# EAGLE schematic circuito (EAGLE 7.1.0)
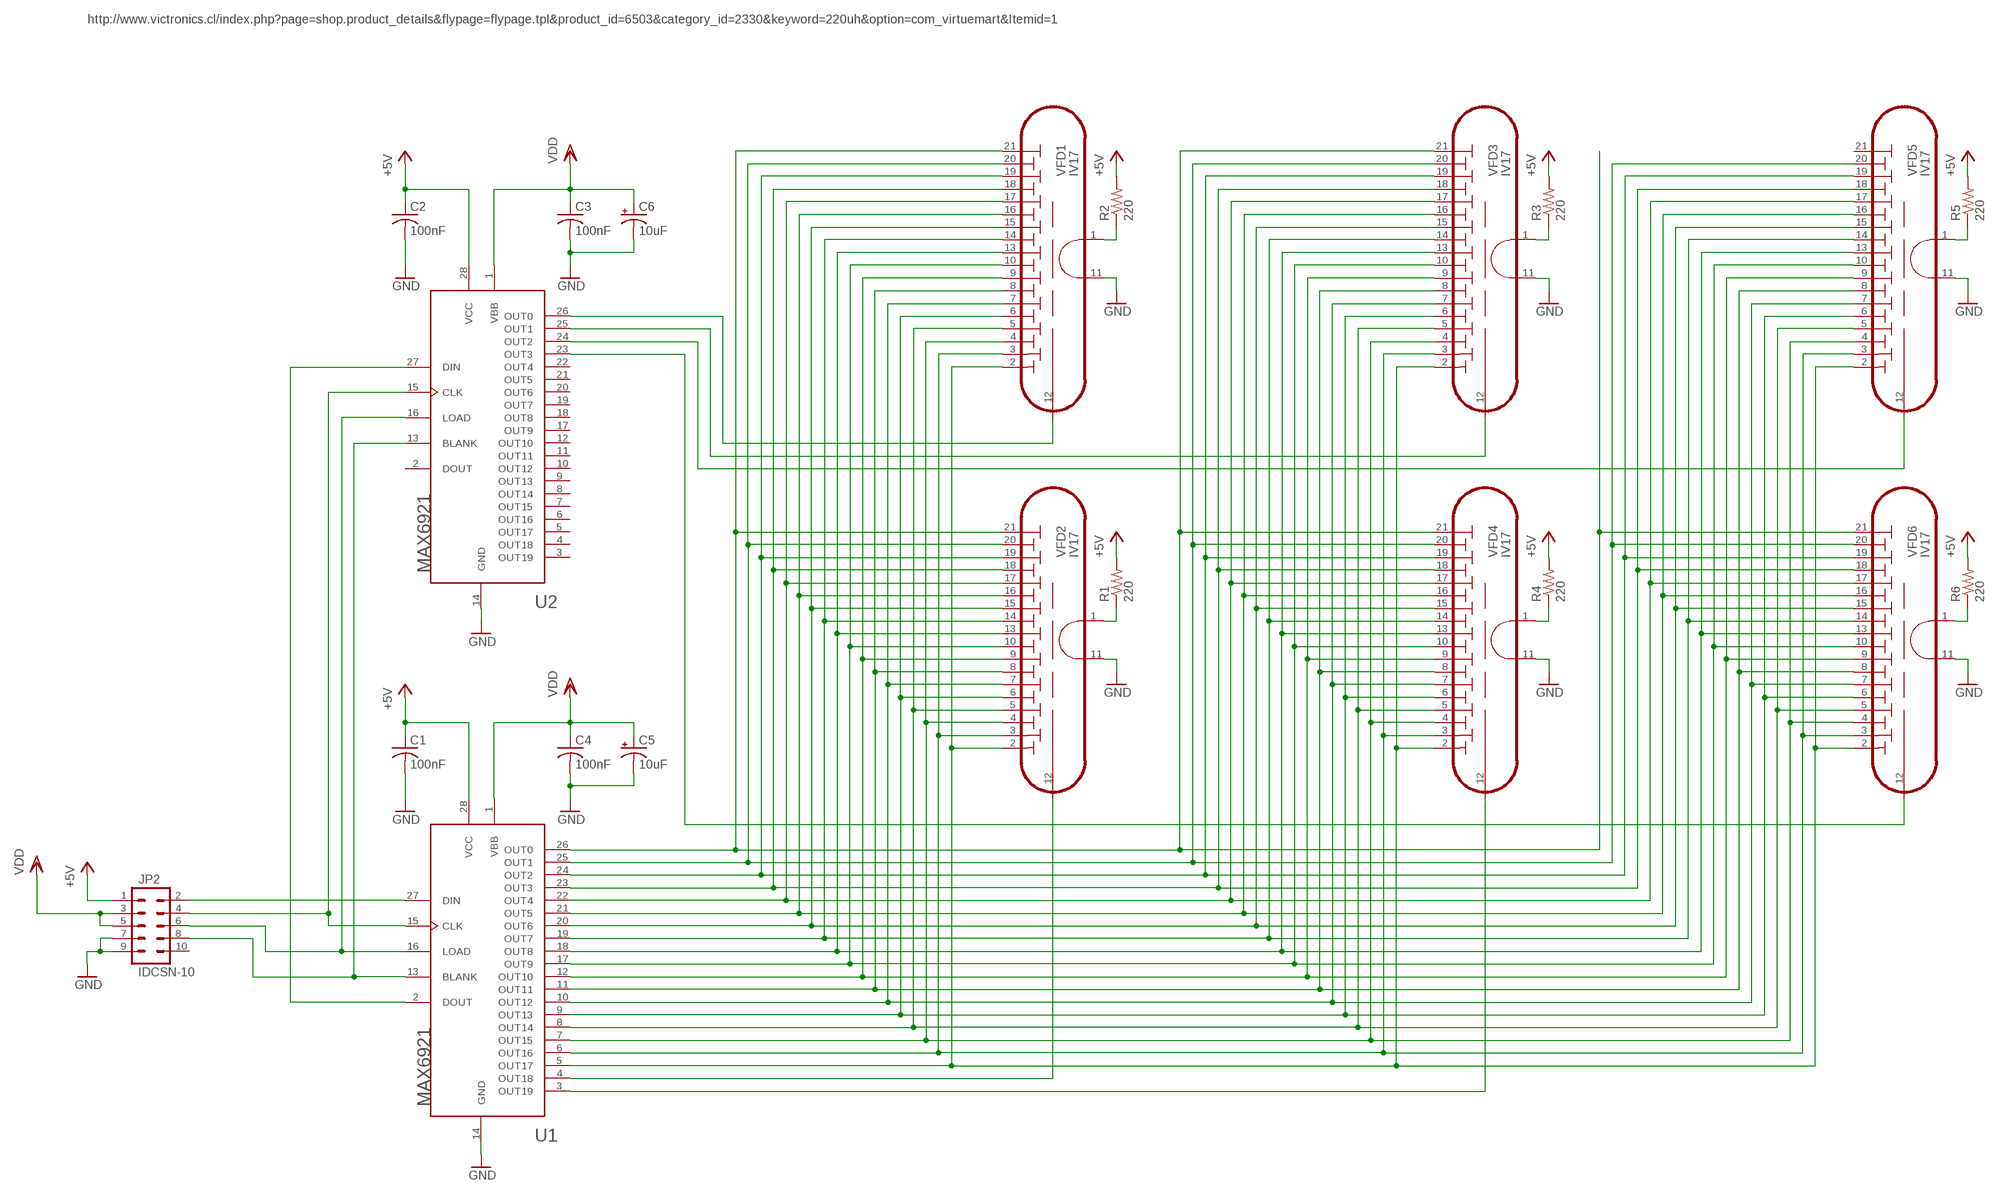
[diagram p0: schematic, sheet 1]

## Parts
C1  100nF  C-USC1206  [C1206]
C2  100nF  C-USC1206  [C1206]
C3  100nF  C-USC1210  [C1210]
C4  100nF  C-USC1210  [C1210]
C5  NACEW100M100V6.3X8TR  [NACEW100M100V6.3X8TR]
C6  NACEW100M100V6.3X8TR  [NACEW100M100V6.3X8TR]
JP2  IDCSN-10  [IDCSN-10]
R1  220  RESISTORPTH-1/4W  [AXIAL-0.4]
R2  220  RESISTORPTH-1/4W  [AXIAL-0.4]
R3  220  RESISTORPTH-1/4W  [AXIAL-0.4]
R4  220  RESISTORPTH-1/4W  [AXIAL-0.4]
R5  220  RESISTORPTH-1/4W  [AXIAL-0.4]
R6  220  RESISTORPTH-1/4W  [AXIAL-0.4]
U1  MAX6921AWI  [SO28W]
U2  MAX6921AWI  [SO28W]
VFD1  IV17  [CIRCULAR]
VFD2  IV17  [CIRCULAR]
VFD3  IV17  [CIRCULAR]
VFD4  IV17  [CIRCULAR]
VFD5  IV17  [CIRCULAR]
VFD6  IV17  [CIRCULAR]

## Nets
+5V [VCC]: C1.1 C2.1 JP2.1 R1.P$2 R2.P$2 R3.P$2 R4.P$2 R5.P$2 R6.P$2 U1.28(VCC) U2.28(VCC)
GND [GND]: C1.2 C2.2 C3.2 C4.2 C5.NEG(-) C6.NEG(-) JP2.7 JP2.9 U1.14(GND) U2.14(GND) VFD1.11 VFD2.11 VFD3.11 VFD4.11 VFD5.11 VFD6.11
N$1: U1.5(OUT17) VFD1.2 VFD2.2 VFD3.2 VFD4.2 VFD5.2 VFD6.2
N$2: R2.P$1 VFD1.1
N$3: U1.7(OUT15) VFD1.4 VFD2.4 VFD3.4 VFD4.4 VFD5.4 VFD6.4
N$4: R1.P$1 VFD2.1
N$5: U1.9(OUT13) VFD1.6 VFD2.6 VFD3.6 VFD4.6 VFD5.6 VFD6.6
N$6: R3.P$1 VFD3.1
N$7: U1.11(OUT11) VFD1.8 VFD2.8 VFD3.8 VFD4.8 VFD5.8 VFD6.8
N$8: U1.12(OUT10) VFD1.9 VFD2.9 VFD3.9 VFD4.9 VFD5.9 VFD6.9
N$9: R6.P$1 VFD6.1
N$10: U1.18(OUT8) VFD1.13 VFD2.13 VFD3.13 VFD4.13 VFD5.13 VFD6.13
N$11: R5.P$1 VFD5.1
N$12: U1.20(OUT6) VFD1.15 VFD2.15 VFD3.15 VFD4.15 VFD5.15 VFD6.15
N$13: U1.21(OUT5) VFD1.16 VFD2.16 VFD3.16 VFD4.16 VFD5.16 VFD6.16
N$14: U1.22(OUT4) VFD1.17 VFD2.17 VFD3.17 VFD4.17 VFD5.17 VFD6.17
N$15: R4.P$1 VFD4.1
N$16: U1.24(OUT2) VFD1.19 VFD2.19 VFD3.19 VFD4.19 VFD5.19 VFD6.19
N$17: U1.25(OUT1) VFD1.20 VFD2.20 VFD3.20 VFD4.20 VFD5.20 VFD6.20
N$18: U1.4(OUT18) VFD2.12
N$19: U1.3(OUT19) VFD4.12
N$20: U1.6(OUT16) VFD1.3 VFD2.3 VFD3.3 VFD4.3 VFD5.3 VFD6.3
N$21: U2.26(OUT0) VFD1.12
N$22: U1.8(OUT14) VFD1.5 VFD2.5 VFD3.5 VFD4.5 VFD5.5 VFD6.5
N$23: U2.25(OUT1) VFD3.12
N$24: U1.10(OUT12) VFD1.7 VFD2.7 VFD3.7 VFD4.7 VFD5.7 VFD6.7
N$25: U2.24(OUT2) VFD5.12
N$26: U2.23(OUT3) VFD6.12
N$27: U1.17(OUT9) VFD1.10 VFD2.10 VFD3.10 VFD4.10 VFD5.10 VFD6.10
N$28: U1.2(DOUT) U2.27(DIN)
N$29: U1.19(OUT7) VFD1.14 VFD2.14 VFD3.14 VFD4.14 VFD5.14 VFD6.14
N$30: JP2.4 U1.15(CLK) U2.15(CLK)
N$31: JP2.6 U1.16(LOAD) U2.16(LOAD)
N$32: JP2.8 U1.13(BLANK) U2.13(BLANK)
N$33: U1.23(OUT3) VFD1.18 VFD2.18 VFD3.18 VFD4.18 VFD5.18 VFD6.18
N$34: JP2.2 U1.27(DIN)
N$54: U1.26(OUT0) VFD1.21 VFD2.21 VFD3.21 VFD4.21 VFD6.21
VDD [VBB]: C3.1 C4.1 C5.POS(+) C6.POS(+) JP2.3 JP2.5 U1.1(VBB) U2.1(VBB)
Unconnected: JP2.10 U2.2(DOUT) U2.3(OUT19) U2.4(OUT18) U2.5(OUT17) U2.6(OUT16) U2.7(OUT15) U2.8(OUT14) U2.9(OUT13) U2.10(OUT12) U2.11(OUT11) U2.12(OUT10) U2.17(OUT9) U2.18(OUT8) U2.19(OUT7) U2.20(OUT6) U2.21(OUT5) U2.22(OUT4) VFD5.21

## Notes on the sheet
- http://www.victronics.cl/index.php?page=shop.product_details&flypage=flypage.tpl&product_id=6503&category_id=2330&keyword=220uh&option=com_virtuemart&Itemid=1

## Library data of the parts
C1-C4 = rcl:C-US: CAPACITOR, American symbol
C5 C6 = iv17:NACEW100M100V6.3X8TR: NACEW100M100V6.3X8TR 10uF 100v Surface Mount Aluminum Electrolytic Capacitor NACEW Series
JP2 = iv17:IDCSN-10: Conector idc 10p 90grad No parte: IDCSN-10 Fabricante: METALTEX
R1-R6 = SparkFun-Passives:RESISTOR: Resistor Basic schematic elements and footprints for 0603, 1206, and PTH resistors.
U1 U2 = iv17:MAX6921AWI: MAX6921AWI VFD Tube Drivers 20-Output, 76V, Serial-Interfaced
VFD1-VFD6 = iv17:IV17: IV-17 VFD 18seg display

## Net classes
1 GND: width 0.61 mm, clearance 0.203 mm
2 VCC: width 0.406 mm
3 VBB: width 0.406 mm, clearance 0.203 mm